# EAGLE design dali-filter (EAGLE 5.09)
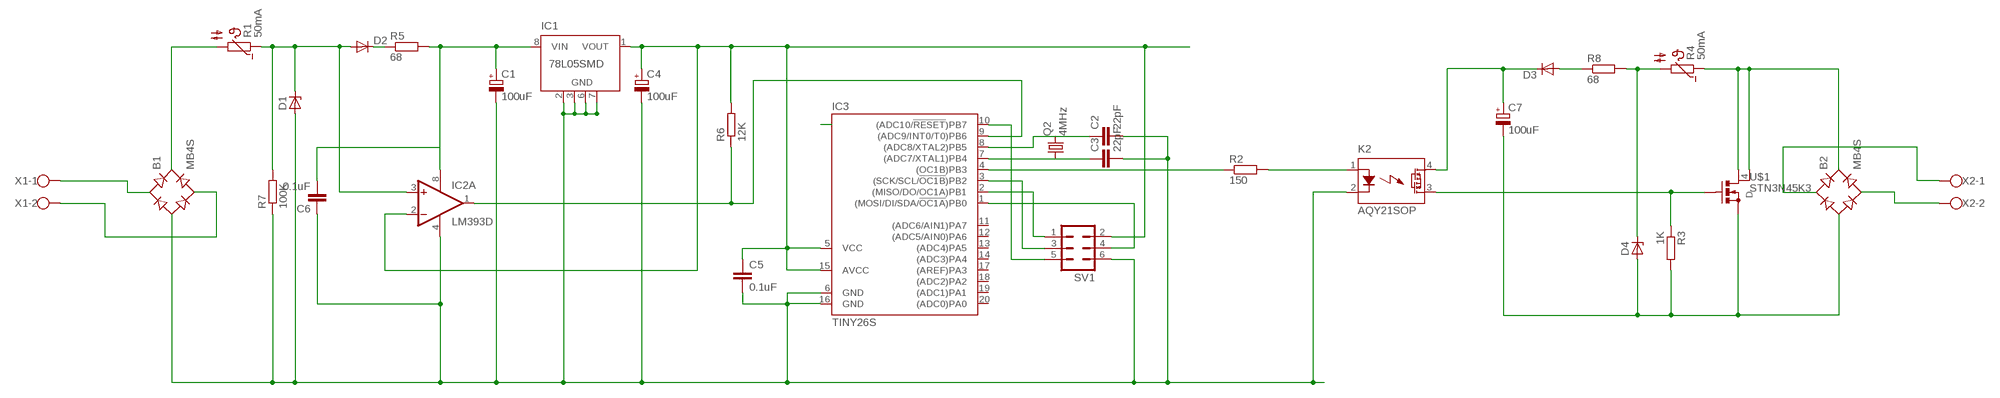
[diagram p0: schematic, sheet 1]

## Parts
B1  MB4S  [SOIC-4]
B2  MB4S  [SOIC-4]
C1  100uF  CPOL-EUE3.5-8  [E3,5-8]
C2  22pF  C-EUC0603  [C0603]
C3  22pF  C-EUC0603  [C0603]
C4  100uF  CPOL-EUE3.5-8  [E3,5-8]
C5  0.1uF  C-EUC0603  [C0603]
C6  0.1uF  C-EUC0603  [C0603]
C7  100uF  CPOL-EUE3.5-8  [E3,5-8]
D1  ZENER-DIODESMB  [SMB]
D2  DIODE-SOD123  [SOD123]
D3  DIODE-SOD123  [SOD123]
D4  ZENER-DIODESMB  [SMB]
IC1  78L05SMD  [SO08]
IC2  LM393D  [SO08]
IC3  TINY26S  [SO20L]
K2  AQY21SOP  [SOP04]
Q2  4MHz  CRYSTALHC49UP  [HC49UP]
R1  50mA  LVR005K  [P642]
R2  150  R-EU_R0603  [R0603]
R3  1K  R-EU_R0603  [R0603]
R4  50mA  LVR005K  [P642]
R5  68  R-EU_R0603  [R0603]
R6  12K  R-EU_R0603  [R0603]
R7  100K  R-EU_R0603  [R0603]
R8  68  R-EU_R0603  [R0603]
SV1  MA03-2  [MA03-2]
U$1  STN3N45K3  [SOT223]
X1  W237-102  [W237-102]
X2  W237-102  [W237-102]

## Nets
GND: B1.- C1.- C2.2 C3.2 C4.- C5.2 C6.1 D1.A IC1.2(GND) IC1.3(GND) IC1.6(GND) IC1.7(GND) IC2.4(P:V-) IC3.6(GND) IC3.16(GND) K2.2(K) R7.1 SV1.6
GND2: B2.- C7.- D4.A R3.2 U$1.3(S)
N$1: D1.C D2.A IC2.3(A:+IN) R1.1 R7.2
N$2: K2.3(DS2) R3.1 U$1.1(G)
N$3: B1.+ R1.2
N$4: C4.+ C5.1 IC1.1(VOUT) IC2.2(A:-IN) IC3.5(VCC) IC3.15(AVCC) R6.2 SV1.2
N$6: C7.+ D3.C K2.4(DS1)
N$7: C2.1 IC3.8((ADC8/XTAL2)PB5) Q2.2
N$8: C3.1 IC3.7((ADC7/XTAL1)PB4) Q2.1
N$9: K2.1(A) R2.2
N$11: C1.+ C6.2 IC1.8(VIN) IC2.8(P:V+) R5.2
N$12: B2.+ R4.1 U$1.2(D) U$1.4(D)
N$13: B1.~1(AC1) X1.1
N$14: B1.~2(AC2) X1.2
N$15: B2.~2(AC2) X2.2
N$16: B2.~1(AC1) X2.1
N$18: IC3.4((OC1B)PB3) R2.1
N$19: IC2.1(A:OUT) IC3.9((ADC9/INT0/T0)PB6) R6.1
N$21: IC3.2((MISO/DO/OC1A)PB1) SV1.1
N$22: IC3.3((SCK/SCL/!OC1B!)PB2) SV1.3
N$23: IC3.10((ADC10/!RESET!)PB7) SV1.5
N$24: IC3.1((MOSI/DI/SDA/!OC1A!)PB0) SV1.4
N$25: D2.C R5.1
N$27: D4.C R4.2 R8.2
N$28: D3.A R8.1
Unconnected: IC1.4(NC) IC1.5(NC) IC2.5(B:+IN) IC2.6(B:-IN) IC2.7(B:OUT) IC3.11((ADC6/AIN1)PA7) IC3.12((ADC5/AIN0)PA6) IC3.13((ADC4)PA5) IC3.14((ADC3)PA4) IC3.17((AREF)PA3) IC3.18((ADC2)PA2) IC3.19((ADC1)PA1) IC3.20((ADC0)PA0)

## Library data of the parts
B1 B2 = rectifier:MB*S: Bridge Rectifier Source: http://www.fairchildsemi.com/ds/MB/MB6S.pdf
C1 C4 C7 = resistor:CPOL-EU: POLARIZED CAPACITOR, European symbol
C2 C3 C5 C6 = resistor:C-EU: CAPACITOR, European symbol
D1 D4 = diode:ZENER-DIODE: Z-Diode
D2 D3 = diode:DIODE-: DIODE
IC1 = linear:78L*SMD: Positive VOLTAGE REGULATOR
IC2 = linear:LM393: COMPARATOR
IC3 = atmel:TINY26*: 8-bit AVR Microcontroller with 2K Bytes Flash Source: http://www.atmel.com .. doc1477.pdf
K2 = relay:AQY*: PhotoMOS Relay NAiS Source: http://www.mew-europe.com/.. pti_en.pdf
Q2 = crystal:CRYSTAL: CRYSTAL
R1 R4 = __SR:LVR005K: TE CONNECTIVITY / RAYCHEM - LVR005K - POLYSWITCH, 0.05A
R2 R3 R5-R8 = resistor:R-EU_: RESISTOR, European symbol
SV1 = con-lstb:MA03-2: PIN HEADER
U$1 = __SR:STN3N45K3
X1 X2 = con-wago-500:W237-102: WAGO SCREW CLAMP

## Board
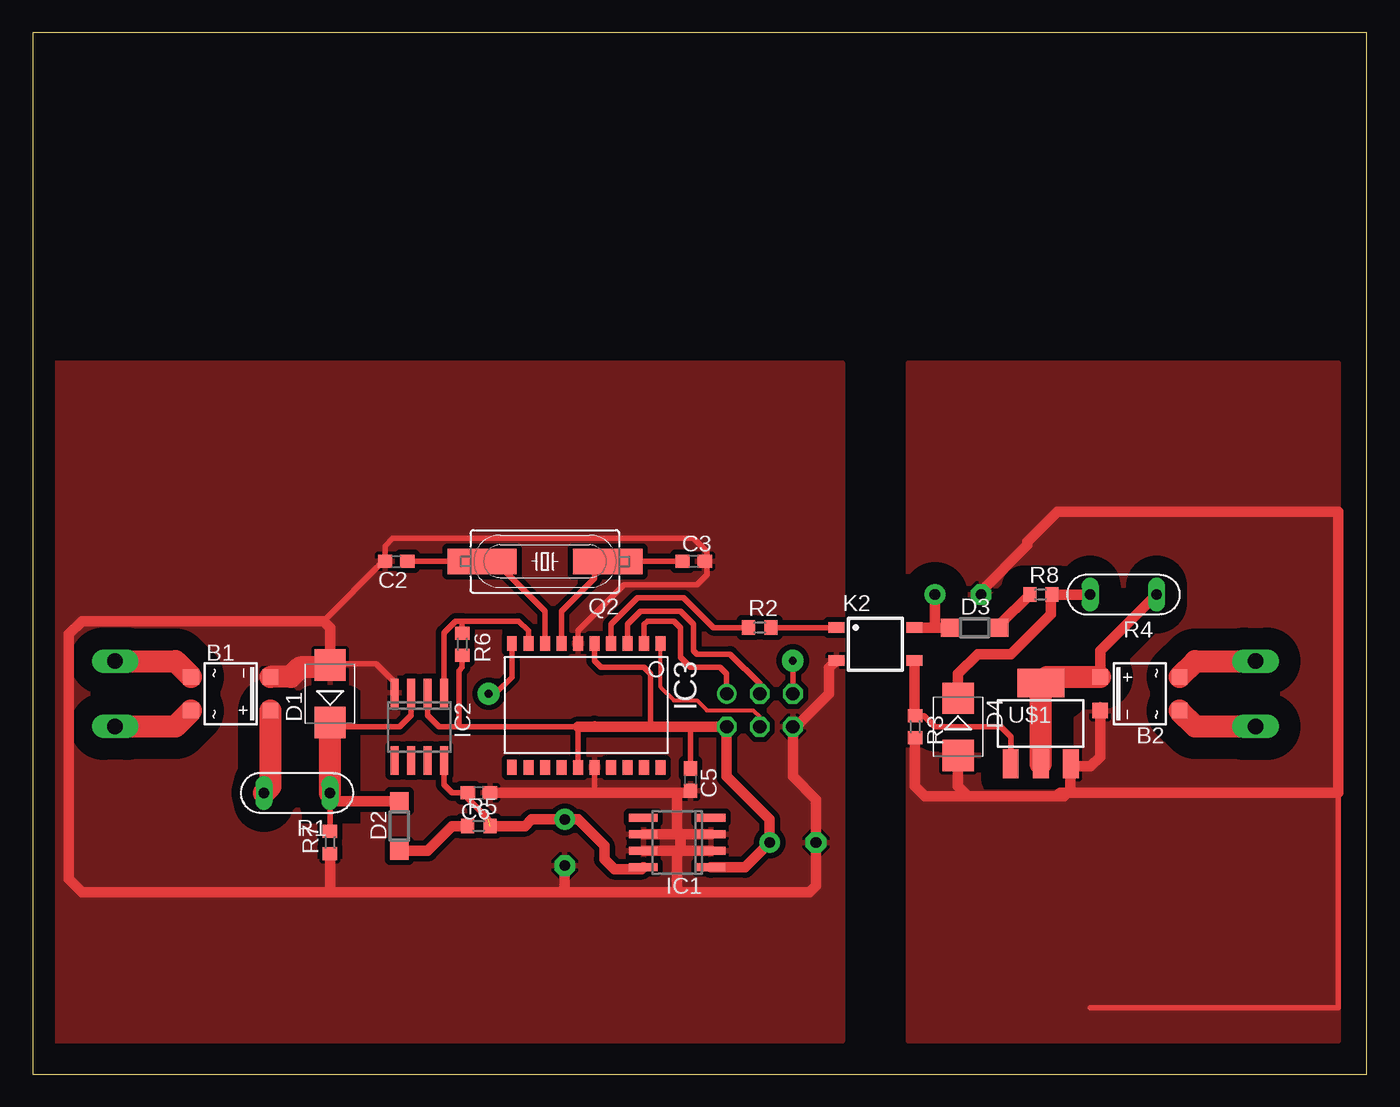
[diagram p1: board, top side]
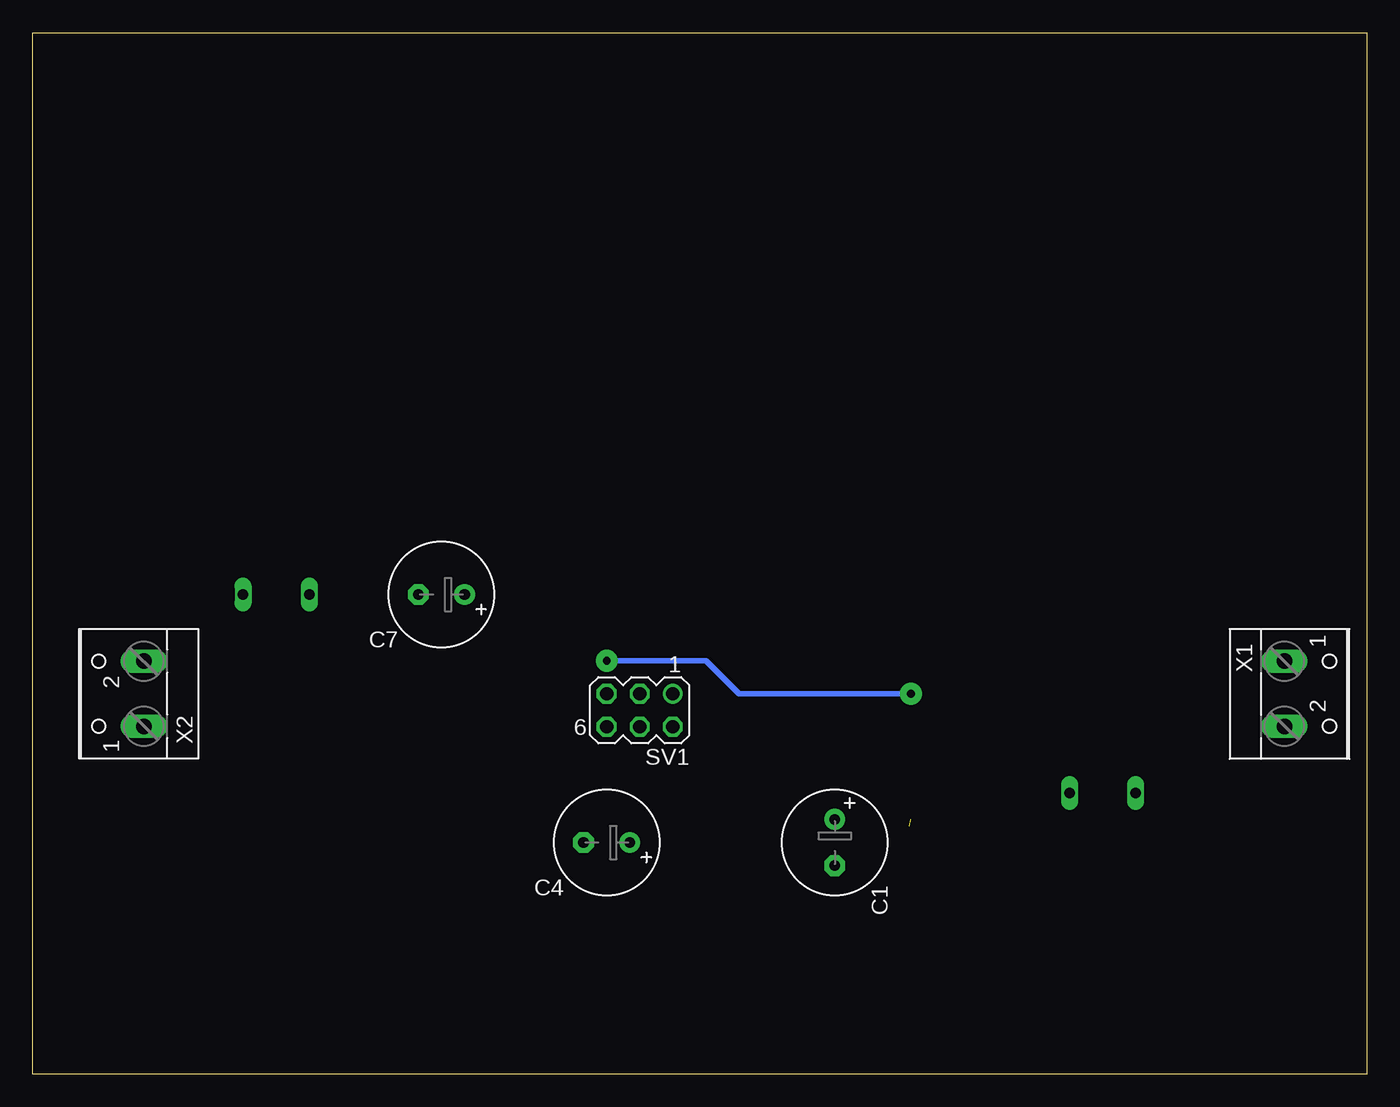
[diagram p2: board, bottom side, seen from below]

Size 102.54 x 80 mm. Coordinates in mm from the lower left corner, seen from the top.
Outline: 0,0 102.54,0 102.54,80 0,80 0,0
Copper layers (1*16): Top 0.035mm / dielectric 1.5mm / Bottom 0.035mm
Design rules "default *": minimum track width 10mil, minimum drill 24mil, track to track 8mil, track to pad 8mil, pad to pad 8mil, via to via 8mil, smd to smd 8mil, copper to edge 40mil, drill to drill 8mil, minimum pad ring 10mil, minimum via ring 8mil, stop-mask expansion 4mil, vias tented up to drill 0mil, thermal gap 10mil

### Footprints (pad centres in the part's own frame; a part is rotated, then mirrored left to right if it is on the bottom)
SOIC-4 = smd 1.2 x 1.2: + 1.3,3.05; - -1.3,3.05; ~1 -1.3,-3.05; ~2 1.3,-3.05
E3,5-8 = drill 0.813 pad 1.6 round: + -1.778,0 | drill 0.813 pad 1.6 octagon: - 1.778,0
C0603 = smd 1.1 x 1: 1 -0.85,0; 2 0.85,0
SMB = smd 2.4 x 2.4: A 2.2,0; C -2.2,0
SOD123 = smd 1.4 x 1.4: A 1.9,0; C -1.9,0
SO08 = smd 0.6 x 2.2: 1 -1.905,-2.6; 2 -0.635,-2.6; 3 0.635,-2.6; 4 1.905,-2.6; 5 1.905,2.6; 6 0.635,2.6; 7 -0.635,2.6; 8 -1.905,2.6
SO20L = smd 0.762 x 1.143: 1 -5.08,-5.131; 2 -3.81,-5.131; 3 -2.54,-5.131; 4 -1.27,-5.131; 5 0,-5.131; 6 1.27,-5.131; 7 2.54,-5.131; 8 3.81,-5.131; 9 5.08,-5.131; 10 6.35,-5.131; 11 6.35,4.369; 12 5.08,4.394; 13 3.81,4.394; 14 2.54,4.394; 15 1.27,4.394; 16 0,4.394; 17 -1.27,4.394; 18 -2.54,4.394; 19 -3.81,4.394; 20 -5.08,4.394
SOP04 = smd 0.8 x 1.2: 1 -1.27,-3; 2 1.27,-3; 3 1.27,3; 4 -1.27,3
HC49UP = smd 5.334 x 1.93: 1 -4.826,0; 2 4.826,0
P642 = drill 0.813 long: 1 -2.54,0; 2 2.54,0
R0603 = smd 1 x 1.1: 1 -0.85,0; 2 0.85,0
MA03-2 = drill 1.016 round: 1 -2.54,-1.27 | drill 1.016 octagon: 2 -2.54,1.27; 3 0,-1.27; 4 0,1.27; 5 2.54,-1.27; 6 2.54,1.27
SOT223 = smd 1.219 x 2.235: 1 -2.311,-3.099; 2 0,-3.099; 3 2.311,-3.099 | smd 3.6 x 2.2: 4 0,3.099
W237-102 = drill 1.194 long: 1 -2.5,-1.27; 2 2.5,-1.27

### Placement (x,y rotation side)
B1  15.24,29.21 270 top
B2  85.09,29.21 90 top
C1  40.89,17.78 270 bottom
C2  27.94,39.37 180 top
C3  50.8,39.37 0 top
C4  58.42,17.78 180 bottom
C5  50.55,22.61 270 top
C6  34.29,21.59 180 top
C7  71.12,36.83 180 bottom
D1  22.86,29.21 90 top
D2  28.19,19.05 90 top
D3  72.39,34.29 0 top
D4  71.12,26.67 270 top
IC1  49.53,17.78 90 top
IC2  29.72,26.67 180 top
IC3  43.18,27.94 180 top
K2  64.77,33.02 270 top
Q2  39.37,39.37 180 top
R1  20.32,21.59 180 top
R2  55.88,34.29 0 top
R3  67.82,26.67 270 top
R4  83.82,36.83 180 top
R5  34.29,19.05 0 top
R6  33.02,33.02 270 top
R7  22.86,17.78 90 top
R8  77.47,36.83 0 top
SV1  55.88,27.94 180 bottom
U$1  77.47,26.92 0 top
X1  5.08,29.21 270 bottom
X2  95.25,29.21 90 bottom

### Tracks (layer width: path | path; a pad name or v marks a point on that pad's centre or on a via)
GND
  Top 0.406: 43.18,21.59 IC3.16 | IC3.6 41.91,34.04 45.47,37.59 51.05,37.59 51.82,38.35 51.82,39.2 C3.2 51.82,39.54 51.82,40.13 50.8,41.15 27.69,41.15 27.09,40.55 C2.2 26.92,39.37 22.35,34.8 | IC2.4 27.81,30.1 26.42,31.5 22.95,31.5 D1.A
  Top 0.813: C5.2 50.38,21.59 49.53,21.59 | 49.53,21.59 43.18,21.59 C6.1 | D1.A 22.86,34.29 22.35,34.8 3.81,34.8 2.79,33.78 2.79,14.99 3.81,13.97 22.86,13.97 | K2.2 61.21,31.19 61.21,29.21 58.67,26.67 SV1.6 58.42,22.86 60.2,21.08 C4.- 60.2,14.48 59.69,13.97 49.53,13.97 | 49.78,18.41 IC1.6 | 49.78,18.41 IC1.3 | 49.53,17.14 IC1.7 | 49.53,17.14 IC1.2 | 49.53,21.59 49.53,18.67 49.78,18.41 | 49.78,18.41 49.78,17.4 49.53,17.14 | 22.86,13.97 40.64,13.97 | 40.64,13.97 49.53,13.97 | 22.86,13.97 R7.1 | C1.- 40.89,14.22 40.64,13.97 | 49.53,13.97 49.53,17.14
  Top 1.676: B1.- 19.84,30.51 20.57,31.24 22.69,31.24 D1.A
  pour Top (isolate 0.406): 25.4,54.61 62.23,54.61 62.23,2.54 25.4,2.54
  pour Top (isolate 1.676): 1.27,2.54 1.27,54.61 25.4,54.61 25.4,2.54
  pour Top: 2.54,12.7 2.54,21.59 11.43,21.59 15.24,16.51 15.24,12.7
  pour Top: 3.81,41.91 11.43,41.91 11.43,35.56 3.81,35.56
GND2
  Top 0.406: B2.- 82.04,28.36 | 100.33,21.59 100.33,5.08 81.28,5.08
  Top 0.813: B2.- 82.04,24.38 81.28,23.62 79.98,23.62 U$1.3 79.76,23.8 79.76,21.84 79.25,21.34 78.74,21.34 | D4.A 71.12,22.1 71.88,21.34 | 78.74,21.34 71.88,21.34 | R3.2 67.82,22.1 68.58,21.34 71.88,21.34 | C7.- 72.9,37.08 76.45,40.64 76.45,40.89 78.74,43.18 100.33,43.18 100.33,21.59 78.99,21.59 78.74,21.34
  pour Top (isolate 1.676): 67.31,54.61 67.31,2.54 100.33,2.54 100.33,54.61
  pour Top: 67.31,21.84 100.33,21.84 100.33,8.89 67.31,8.89
N$1
  Top 0.406: IC2.3 29.08,27.56 28.19,26.67 23.2,26.67 D1.C | R7.2 R1.1
  Top 0.813: R1.1 23.5,20.95 D2.A
  Top 1.676: R1.1 D1.C
N$2
  Top 0.406: R3.1 68.49,27.52 69.34,26.67 74.42,26.67 75.18,25.91 75.18,23.85 U$1.1
  Top 0.813: K2.3 67.77,27.57 R3.1
N$3
  Top 1.676: B1.+ 18.29,22.1 R1.2
N$4
  Top 0.406: IC3.15 41.91,26.67 32.77,26.67 | 43.43,26.67 43.18,26.92 | 50.55,26.67 C5.1 | IC2.2 30.35,27.56 31.24,26.67 32.77,26.67 | R6.2 33.02,31.24 32.77,30.99 32.77,26.67 | IC3.5 43.18,31.75 43.69,31.24 46.99,31.24 47.5,30.73 47.5,26.92 47.75,26.67
  Top 0.813: 41.91,26.67 43.43,26.67 47.75,26.67 50.55,26.67 SV1.2 53.34,22.86 56.64,19.56 C4.+ 54.74,15.88 IC1.1
N$6
  Top 0.813: K2.4 69.34,34.29 | 69.34,34.29 D3.C | 69.34,34.29 C7.+
N$7
  Top 0.406: IC3.8 39.37,35.56 35.56,39.37 Q2.2 C2.1
N$8
  Top 0.406: C3.1 Q2.1 43.18,39.37 43.18,38.1 40.64,35.56 IC3.7
N$9
  Top 0.406: R2.2 K2.1
N$10
  pour Top: 88.9,35.56 88.9,43.18 99.06,43.18 99.06,35.56
N$11  (1 unrouted)
  Top 0.406: IC2.8 31.62,22.23 32.26,21.59 C6.2 33.44,21.17 35.05,19.56
  Top 0.813: IC1.8 46.8,15.75 44.7,15.75 43.94,16.51 43.94,17.53 41.91,19.56 C1.+ 38.35,19.56 37.85,19.05 R5.2
N$12
  Top 0.406: 82.55,30.51 B2.+ 82.04,30.56
  Top 0.813: U$1.4 77.96,30.51 | 86.36,36.32 R4.1 82.04,32.51 B2.+
  Top 1.676: U$1.2 U$1.4 | 77.96,30.51 B2.+
N$13
  Top 1.676: X1.1 10.99,31.71 B1.~1
N$14
  Top 1.676: X1.2 10.99,26.71 B1.~2
N$15
  Top 1.676: X2.2 89.34,31.71 B2.~2
N$16
  Top 1.676: X2.1 89.34,26.71 B2.~1
N$18
  Top 0.406: IC3.4 44.45,34.54 46.48,36.58 50.04,36.58 52.32,34.29 R2.1
N$19
  Top 0.406: IC2.1 31.62,33.91 32.51,34.8 33.02,34.8 | 33.02,34.8 37.34,34.8 38.1,34.04 IC3.9 | 33.02,34.8 R6.1
N$21
  Top 0.406: SV1.1 53.34,30.73 52.83,31.24 50.55,31.24 49.78,32 49.78,34.29 49.28,34.8 47.24,34.8 46.99,34.54 IC3.2
N$22
  Top 0.406: IC3.3 45.72,34.54 46.74,35.56 49.78,35.56 50.8,34.54 50.8,32.51 51.05,32.26 53.59,32.26 55.88,29.97 SV1.3
N$23  (via drill 0.6 pad 1.68)
  Top 0.406: IC3.10 36.83,30.48 35.56,29.21 v35.05,29.21 | v58.42,31.75 SV1.5
  Bottom 0.406: v35.05,29.21 48.26,29.21 50.8,31.75 v58.42,31.75
N$24
  Top 0.305: SV1.4 55.88,27.43 55.37,27.94 51.82,27.94 51.05,28.7 49.28,28.7 48.26,29.72 IC3.1
N$25
  Top 0.813: D2.C 30.36,17.15 32.26,19.05 R5.1
N$26
  pour Top (isolate 0.406): 25.4,19.05 20.32,19.05 20.32,2.54 25.4,2.54
N$27
  Top 0.813: D4.C 71.12,30.73 72.64,32.26 75.18,32.26 78.23,35.31 78.23,36.74 R8.2 R4.2
N$28
  Top 0.813: D3.A 74.29,34.5 R8.1

### Text on the board
tRestrict: IN | OUT | Feb | DALI Duplicate | 2013 | Command Filter v2.0